# Altium schematic sheet MCU.SchDoc: Microcontroller and Sensors
size B; Author: Sébastien Gélinas; Organization: SmartHalo; Address1: 5445 de Gaspé; Address2: Montréal, QC; Address3: Canada; Address4: H2T 3B2; DocumentNumber: 2; Revision: 1; SheetNumber: 2; SheetTotal: 4
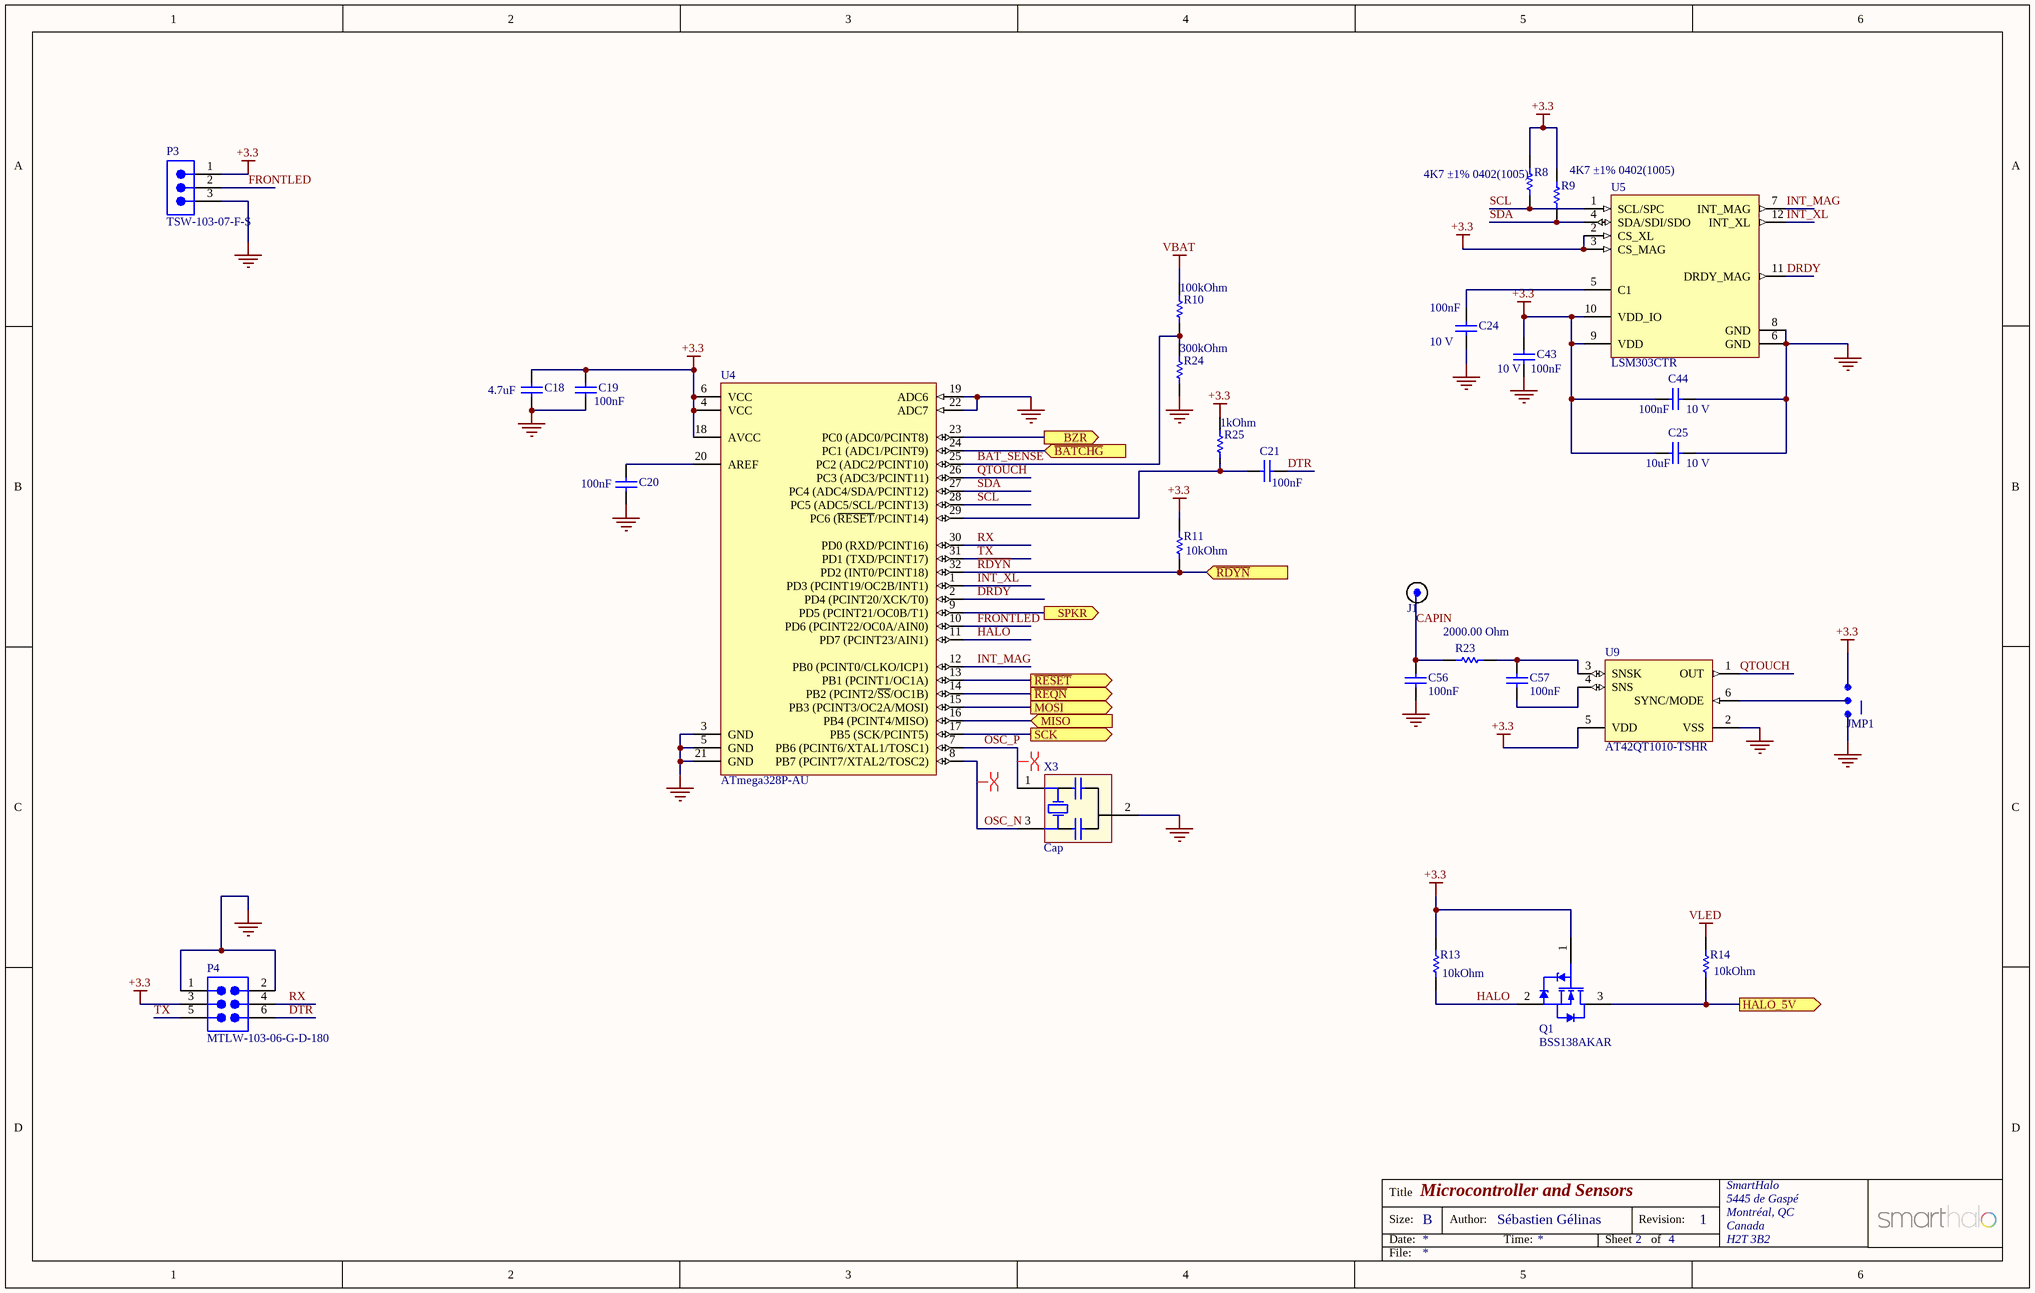
[diagram p0: MCU.SchDoc]

## Parts
C18  Capacitance: 4.7uF  [CAPC0603(1608)55_N]  (hidden comment: CAP 4.7uF 10V 0603(1608))
C19  Capacitance: 100nF  [CAPC0402(1005)60_L]  (hidden comment: CAP 100nF 10V 0402(1005))
C20  Capacitance: 100nF  [CAPC0402(1005)60_L]  (hidden comment: CAP 100nF 10V 0402(1005))
C21  Capacitance: 100nF  [CAPC0402(1005)60_M]  (hidden comment: CAP 100nF 6.3V 0402(1005))
C24  Capacitance: 100nF  Rated Voltage: 10 V  [CAPC0402(1005)60_L]  (hidden comment: CAP 100nF 10V 0402(1005))
C25  Rated Voltage: 10 V  Capacitance: 10uF  [CAPC0603(1608)100_N]  (hidden comment: CAP 10uF 10V 0603(1608))
C43  Capacitance: 100nF  Rated Voltage: 10 V  [CAPC0402(1005)60_L]  (hidden comment: CAP 100nF 10V 0402(1005))
C44  Capacitance: 100nF  Rated Voltage: 10 V  [CAPC0402(1005)60_L]  (hidden comment: CAP 100nF 10V 0402(1005))
C56  Capacitance: 100nF  [CAPC0402(1005)60_L]  (hidden comment: CAP 100nF 10V 0402(1005))
C57  Capacitance: 100nF  [CAPC0402(1005)60_L]  (hidden comment: CAP 100nF 10V 0402(1005))
J1  HEADERPIN  [HEADERPIN]  (value not drawn)  (no BOM)
JMP1  JUMPER  [JUMPER_SMT]  (value not drawn)  (no BOM)
P3  TSW-103-07-F-S  [SMTC-TSW-103-07-X-S]  (no BOM)
P4  MTLW-103-06-G-D-180  [SMTC-MTLW-103-06-X-D-180]  (no BOM)
Q1  BSS138AKAR  [NXP-SOT23_N]
R8  4K7 ±1% 0402(1005)  [RESC0402(1005)_N]
R9  4K7 ±1% 0402(1005)  [RESC0402(1005)_N]
R10  Resistance: 100kOhm  [RESC0402(1005)_L]  (hidden comment: 100K ±5% 0402(1005))
R11  Resistance: 10kOhm  [RESC0402(1005)_N]  (hidden comment: 10K ±5% 0402(1005))
R13  Resistance: 10kOhm  [RESC0402(1005)_N]  (hidden comment: 10K ±1% 0402(1005))
R14  Resistance: 10kOhm  [RESC0402(1005)_N]  (hidden comment: 10K 1% 0402(1005))
R23  Resistance: 2000.00 Ohm  [RESC0603(1608)_N]  (hidden comment: 2K ±5% 0603(1608))
R24  Resistance: 300kOhm  [RESC0402(1005)_L]  (hidden comment: 300K ±5% 0402(1005))
R25  Resistance: 1kOhm  [RESC0402(1005)_L]  (hidden comment: 1K ±5% 0402(1005))
U4  ATmega328P-AU  [32A_M]
U5  LSM303CTR  [LGA12-2X2X1_N]
U9  AT42QT1010-TSHR  [6ST1_M]
X3  Cap  [CSTCE10M0G55-R0]

## Ports
BZR, HALO_5V (out), MISO (in), MOSI (out), SCK (out), SPKR, ~{BATCHG} (in), ~{RDYN} (in), ~{REQN} (out), ~{RESET} (out)

## Nets
+3.3: C18.2 C19.2 C25.2 C43.1 C44.2 JMP1.1 P3.1 P4.3 Q1.1(G) R8.2 R9.2 R11.2 R13.2 R25.2 U4.4(VCC) U4.6(VCC) U4.18(AVCC) U5.2(CS_XL) U5.3(CS_MAG) U5.9(VDD) U5.10(VDD_IO) U9.5(VDD)
GND: C18.1 C19.1 C20.1 C24.2 C25.1 C43.2 C44.1 C56.1 JMP1.3 P3.3 P4.1 P4.2 R24.1 U4.3(GND) U4.5(GND) U4.19(ADC6) U4.21(GND) U4.22(ADC7) U5.6(GND) U5.8(GND) U9.2(VSS) X3.2(GND)
VBAT: R10.2
VLED: R14.2
~{BATCHG}: U4.24(PC1_(ADC1/PCINT9)) ; port ~{BATCHG}
BAT_SENSE: R10.1 R24.2 U4.25(PC2_(ADC2/PCINT10))
BZR: U4.23(PC0_(ADC0/PCINT8)) ; port BZR
CAPIN: C56.2 J1.1 R23.2
DRDY: U4.2(PD4_(PCINT20/XCK/T0)) U5.11(DRDY_MAG)
DTR: C21.2 P4.6
FRONTLED: P3.2 U4.10(PD6_(PCINT22/OC0A/AIN0))
HALO: Q1.2(S) R13.1 U4.11(PD7_(PCINT23/AIN1))
HALO_5V: Q1.3(D) R14.1 ; port HALO_5V
INT_MAG: U4.12(PB0_(PCINT0/CLKO/ICP1)) U5.7(INT_MAG)
INT_XL: U4.1(PD3_(PCINT19/OC2B/INT1)) U5.12(INT_XL)
MISO: U4.16(PB4_(PCINT4/MISO)) ; port MISO
MOSI: U4.15(PB3_(PCINT3/OC2A/MOSI)) ; port MOSI
OSC_N: U4.8(PB7_(PCINT7/XTAL2/TOSC2)) X3.3(C2)
OSC_P: U4.7(PB6_(PCINT6/XTAL1/TOSC1)) X3.1(C1)
QTOUCH: U4.26(PC3_(ADC3/PCINT11)) U9.1(OUT)
~{RDYN}: R11.1 U4.32(PD2_(INT0/PCINT18)) ; port ~{RDYN}
~{REQN}: U4.14(PB2_(PCINT2/~{SS}/OC1B)) ; port ~{REQN}
~{RESET}: U4.13(PB1_(PCINT1/OC1A)) ; port ~{RESET}
RX: P4.4 U4.30(PD0_(RXD/PCINT16))
SCK: U4.17(PB5_(SCK/PCINT5)) ; port SCK
SCL: R8.1 U4.28(PC5_(ADC5/SCL/PCINT13)) U5.1(SCL/SPC)
SDA: R9.1 U4.27(PC4_(ADC4/SDA/PCINT12)) U5.4(SDA/SDI/SDO)
SPKR: U4.9(PD5_(PCINT21/OC0B/T1)) ; port SPKR
TX: P4.5 U4.31(PD1_(TXD/PCINT17))
NetC20_2: C20.2 U4.20(AREF)
NetC21_1: C21.1 R25.1 U4.29(PC6_(~{RESET}/PCINT14))
NetC24_1: C24.1 U5.5(C1)
NetC57_1: C57.1 U9.4(SNS)
NetC57_2: C57.2 R23.1 U9.3(SNSK)
NetJMP1_2: JMP1.2 U9.6(SYNC/MODE)

## Layout directives
differential pair: OSC_N, OSC_P

## Notes on the sheet
- Title
- Size:
- Date:
- B
- Author:
- Time:
- Sheet
- Revision:
- of
- File:

## Library data of the parts
C18 = CMP-1035-02784-1: CAP 4.7uF 10V ±10% 0603 (1608 Metric); Case-EIA: 0603; Case-Metric: 1608; Tolerance: ±10%; Rated Voltage: 10 V
C19 C20 C24 C43 C44 C56 C57 = CMP-1034-02064-1: CAP 100nF 10V ±5% 0402 (1005 Metric); Case-EIA: 0402; Case-Metric: 1005; Tolerance: ±5%
  C19 C20 C56 C57: Rated Voltage: 10 V
C21 = CMP-1034-02060-1: CAP 100nF 6.3V ±5% 0402 (1005 Metric); Case-EIA: 0402; Case-Metric: 1005; Rated Voltage: 6.3 V; Tolerance: ±5%
C25 = CMP-1035-02799-1: CAP 10uF 10V ±10% 0603 (1608 Metric); Case-EIA: 0603; Case-Metric: 1608; Tolerance: ±10%
J1 = HEADERPIN: HEADER 0.025" PIN
P3 = SMTC-TSW-103-X-X-S-X: 0.025" SQ Post Header, Through-hole, Vertical, -55 to 125 degC, 2.54 mm Pitch, 3-Pin, Male, RoHS; Manufacturer: Samtec; Pitch: 2.54 mm; DatasheetVersion: F-214; ComponentLink1Description: Manufacturer URL; ComponentLink3URL: http://www.samtec.com/documents/webfiles/cpdf/TSW-XXX-XX-XXX-X-XX-XXX-MKT.pdf; Mounting Technology: Through-hole; PackageDescription: .025[0.64] SQ. Post Terminal Strip Assembly; Temperature Range: -55 to 125 degC; ComponentLink3Description: Package Specification; Orientation: Vertical; PartNumber: TSW-103-07-F-S; RoHS: True; PackageVersion: DM, 8/1988; ComponentLink2Description: Datasheet; ComponentLink1URL: http://www.samtec.com; ComponentLink2URL: http://www.samtec.com/documents/webfiles/pdf/TSW_TH.PDF; PackageReference: TSW-103-07-X-S
P4 = SMTC-MTLW-103-06-X-D-180: Low Profile .025" SQ Post Header, Through-hole, Vertical, -55 to 125 degC, 2.54 mm Pitch, 6-Pin, Male, RoHS; Manufacturer: Samtec; Pitch: 2.54 mm; PartNumber: MTLW-103-06-G-D-180; ComponentLink2Description: Datasheet; ComponentLink3URL: http://www.samtec.com/documents/webfiles/cpdf/MTLW-1XX-XX-XX-X-XXX-XX-XX-MKT1.pdf; ComponentLink1URL: http://www.samtec.com; Orientation: Vertical; PackageVersion: T, 6/1991; PackageDescription: Low Profile Terminal Assembly; ComponentLink3Description: Package Specification; ComponentLink1Description: Manufacturer URL; DatasheetVersion: F-214; Temperature Range: -55 to 125 degC; ComponentLink2URL: http://www.samtec.com/documents/webfiles/pdf/MTLW_TH.PDF; RoHS: True; Mounting Technology: Through-hole; PackageReference: MTLW-103-06-X-D-180
Q1 = CMP-1258-00119-1: Single N-Channel Trench MOSFET, 60 V, 0.2 A, -55 to 150 degC, 3-Pin SOT23, Tape and Reel; Manufacturer: NXP Semiconductors; ID [max] (A): 0.2; VGSth [typ] (V): 1.2; VDS [max] (V): 60; Coss [typ] (pF): 21; Ciss [typ] (pF): 31; Channel Type: N; Packing: Tape & Reel; ComponentLink1URL: http://www.nxp.com/; ComponentLink2URL: http://www.nxp.com/documents/data_sheet/BSS138AKA.pdf; ComponentLink3Description: Package Specification; PackageVersion: 06-03-16, 03/2006; ComponentLink2Description: Datasheet; ComponentLink3URL: http://www.nxp.com/documents/outline_drawing/sot023_po.pdf; PackageDescription: 3-Pin Small Outline Transistor Package, Body 2.9 x 1.3 mm, Pitch 0.95 mm; ComponentLink1Description: Manufacturer URL; PackageReference: SOT23; Code_JEDEC: TO-236AB; DatasheetVersion: Rev. 1; Mounting Technology: Surface Mount; PartNumber: BSS138AKAR
R8 R9 = CMP-1011-00586-1: 4K7 0.063W ±1% 0402 (1005 Metric); Resistance: 4700.00 Ohm; Case-EIA: 0402; Case-Metric: 1005; Power: 0.063 W; Tolerance: ±1 %
R10 = CMP-1011-00074-1: 100K 0.063W ±5% 0402 (1005 Metric); Case-EIA: 0402; Case-Metric: 1005; Tolerance: ±5 %; Power: 0.063 W
R11 = CMP-1011-00098-1: 10K 0.063W ±5% 0402 (1005 Metric); Case-EIA: 0402; Case-Metric: 1005; Tolerance: ±5 %; Power: 0.063 W
R13 R14 = CMP-1011-00623-1: 10K 0.063W ±1% 0402 (1005 Metric); Case-Metric: 1005; Case-EIA: 0402; Tolerance: ±1 %; Power: 0.063 W
R23 = CMP-1012-00081-1: 2K 0.1W ±5% 0603 (1608 Metric); Case-EIA: 0603; Case-Metric: 1608; Tolerance: ±5 %; Power: 0.1 W
R24 = CMP-1011-00074-1: 300K 0.063W ±5% 0402 (1005 Metric); Case-EIA: 0402; Case-Metric: 1005; Tolerance: ±5 %; Power: 0.063 W
R25 = CMP-1011-00074-1: 1K 0.063W ±5% 0402 (1005 Metric); Case-EIA: 0402; Case-Metric: 1005; Tolerance: ±5 %; Power: 0.063 W
U4 = MC-8B-ATM48-SQ32: 8-bit AVR Microcontroller, 32KB Flash, 1KB EEPROM, 2KB SRAM, 32-pin TQFP, Industrial Grade (-40Â°C to 85Â°C); PackageDescription: 32-Lead, 7x7x1.0 mm Body, 0.8mm Lead Pitch, Thin Profile Plastic Quad Flat Package (TQFP); DatasheetVersion: revD, May-2011; RevisionNote: DatasheetVersion & PackageVersion updated. URLs added.; ComponentLink1URL: http://www.atmel.com/; ComponentLink2Description: ATmega48A/48PA/88A/88PA/168A/168PA/328/328P Datasheet; Code_JEDEC: MS-026-ABA; ComponentLink1Description: Manufacturer URL; PackageReference: 32A; ComponentLink3Description: ATmega48A/48PA/88A/88PA/168A/168PA/328/328P Summary; ComponentLink2URL: http://www.atmel.com/dyn/resources/prod_documents/doc8271.pdf; PackageVersion: revC, Oct-2010; ComponentLink3URL: http://www.atmel.com/dyn/resources/prod_documents/8271S.pdf
U5 = SEN-MOT-LSM303CTR-12: 3D ACCELEROMETER/MAGNETOMETER
U9 = CMP-0073-00038-1: One-channel Touch Sensor IC with Reset Timer, -40Â° to +85Â° C, 6-pin SOT23; DatasheetVersion: revH, May-2010; Code_IPC: SOT26A-6; PackageDescription: 6-Lead, 2.90 x 1.60 mm Plastic Small Outline Package (SOT23); PackageVersion: revA, Jun-2008; PackageReference: 6ST1; ComponentLink2Description: Datasheet; ComponentLink2URL: http://www.atmel.com/Images/doc9541.pdf; ComponentLink1URL: http://www.atmel.com/; ComponentLink1Description: Manufacturer URL; Code_JEDEC: MO-178-AB
X3 = CSTCE10M0G55-R0: CER RESONATOR 10.0MHZ SMD